# EAGLE schematic board (EAGLE 9.2.2)
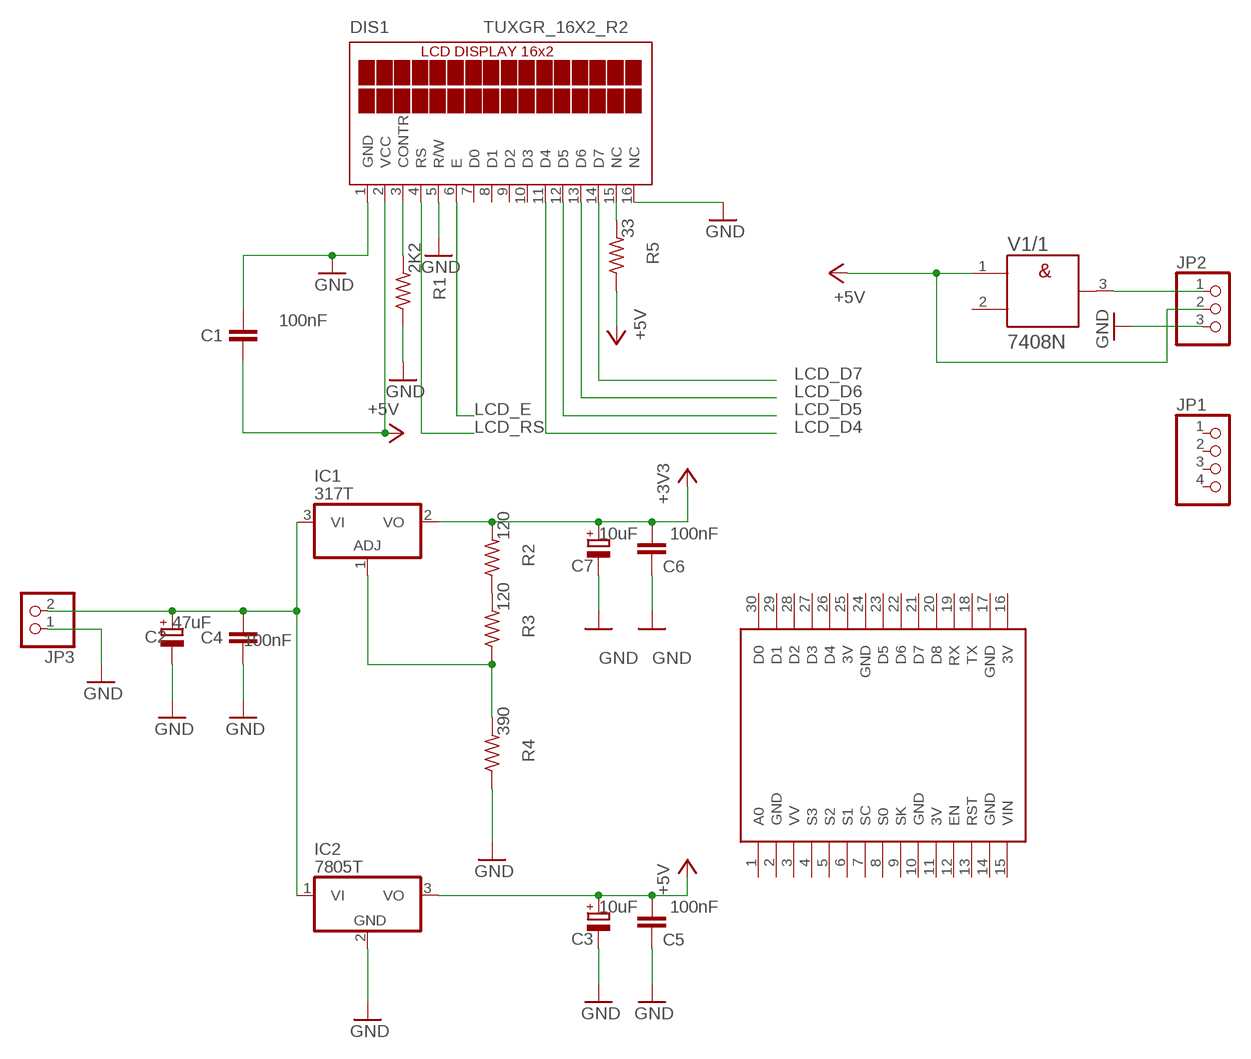
[diagram p0: schematic, sheet 1]

## Parts
C1  C5/3  [C5B3]
C2  CPOL-EUE5-6  [E5-6]
C3  CPOL-EUE5-6  [E5-6]
C4  C5/3  [C5B3]
C5  C5/3  [C5B3]
C6  C5/3  [C5B3]
C7  CPOL-EUE5-6  [E5-6]
DIS1  TUXGR_16X2_R2  [TUXGR_16X2_R2]
IC1  317T  [TO220H]
IC2  7805T  [TO220H]
JP1  PINHD-1X4  [1X04]
JP2  PINHD-1X3  [1X03]
JP3  PINHD-1X2  [1X02]
R1  R-US_0309/12  [0309/12]
R2  R-US_0309/12  [0309/12]
R3  R-US_0309/12  [0309/12]
R4  R-US_0309/12  [0309/12]
R5  R-US_0309/12  [0309/12]
U$1  NODEMCU  [NODEMCU]
V1  7408N  [DIL14]

## Nets
+3V3: C6.1 C7.+ IC1.2(VO) R2.2
+5V: C1.2 C3.+ C5.1 DIS1.2(VCC) IC2.3(VO) JP2.2 R5.1 V1.1(/1:A)
GND: C1.1 C2.- C3.- C4.2 C5.2 C6.2 C7.- DIS1.1(GND) DIS1.5(R/W) DIS1.16(NC) IC2.2(GND) JP2.3 JP3.1 R1.1 R4.1
LCD_D4: DIS1.11(D4)
LCD_D5: DIS1.12(D5)
LCD_D6: DIS1.13(D6)
LCD_D7: DIS1.14(D7)
LCD_E: DIS1.6(E)
LCD_RS: DIS1.4(RS)
N$1: DIS1.3(CONTR) R1.2
N$2: JP2.1 V1.3(/1:Y)
N$3: C2.+ C4.1 IC1.3(VI) IC2.1(VI) JP3.2
N$4: R2.1 R3.2
N$5: IC1.1(ADJ) R3.1 R4.2
N$6: DIS1.15(NC) R5.2
Unconnected: DIS1.7(D0) DIS1.8(D1) DIS1.9(D2) DIS1.10(D3) JP1.1 JP1.2 JP1.3 JP1.4 U$1.1(A0) U$1.3(VV) U$1.4(S3) U$1.5(S2) U$1.6(S1) U$1.7(SC) U$1.8(S0) U$1.9(SK) U$1.12(EN) U$1.13(RST) U$1.15(VIN) U$1.18(TX) U$1.19(RX) U$1.20(D8) U$1.21(D7) U$1.22(D6) U$1.23(D5) U$1.26(D4) U$1.27(D3) U$1.28(D2) U$1.29(D1) U$1.30(D0) V1.2(/1:B) V1.4(/2:A) V1.5(/2:B) V1.6(/2:Y) V1.8(/3:Y) V1.9(/3:A) V1.10(/3:B) V1.11(/4:Y) V1.12(/4:A) V1.13(/4:B)

## Power pins joined to a net without a drawn wire
3V: U$1.11(3V) U$1.16(3V) U$1.25(3V)
+UB: V1.14(/+UB:+UB)
-UB: V1.7(/-UB:-UB)
GND: U$1.2(GND) U$1.10(GND) U$1.14(GND) U$1.17(GND) U$1.24(GND)

## Library data of the parts
C1 C4-C6 = capacitor-wima:C: CAPACITOR naming: grid - package width; CAP: 100nF
C2 = rcl:CPOL-EU: POLARIZED CAPACITOR, European symbol; SPICEPREFIX: 47uF
C3 C7 = rcl:CPOL-EU: POLARIZED CAPACITOR, European symbol; SPICEPREFIX: 10uF
DIS1 = display-lcd:TUXGR_16X2_R2: Tuxgraphics LCD display 16x2 characters reflective, without background light Source: tuxgr_12x2_r2.pdf; OC_FARNELL: unknown; OC_NEWARK: unknown
IC1 = linear:*317: Positive VOLTAGE REGULATOR
IC2 = linear:78*: Positive VOLTAGE REGULATOR Source: http://cache.national.com/ds/LM/LM78L05.pdf http://www.fairchildsemi.com/ds/LM/LM7805.pdf
JP1 = pinhead:PINHD-1X4: PIN HEADER
JP2 = pinhead:PINHD-1X3: PIN HEADER
JP3 = pinhead:PINHD-1X2: PIN HEADER
R1 = rcl:R-US_: RESISTOR, American symbol; SPICEPREFIX: 2K2
R2 R3 = rcl:R-US_: RESISTOR, American symbol; SPICEPREFIX: 120
R4 = rcl:R-US_: RESISTOR, American symbol; SPICEPREFIX: 390
R5 = rcl:R-US_: RESISTOR, American symbol; SPICEPREFIX: 33
U$1 = nodemcu:NODEMCU
V1 = 74ttl-din:74*08: Quad 2-input AND gate